# EAGLE design zeroAdaptor (EAGLE 7.1.0)
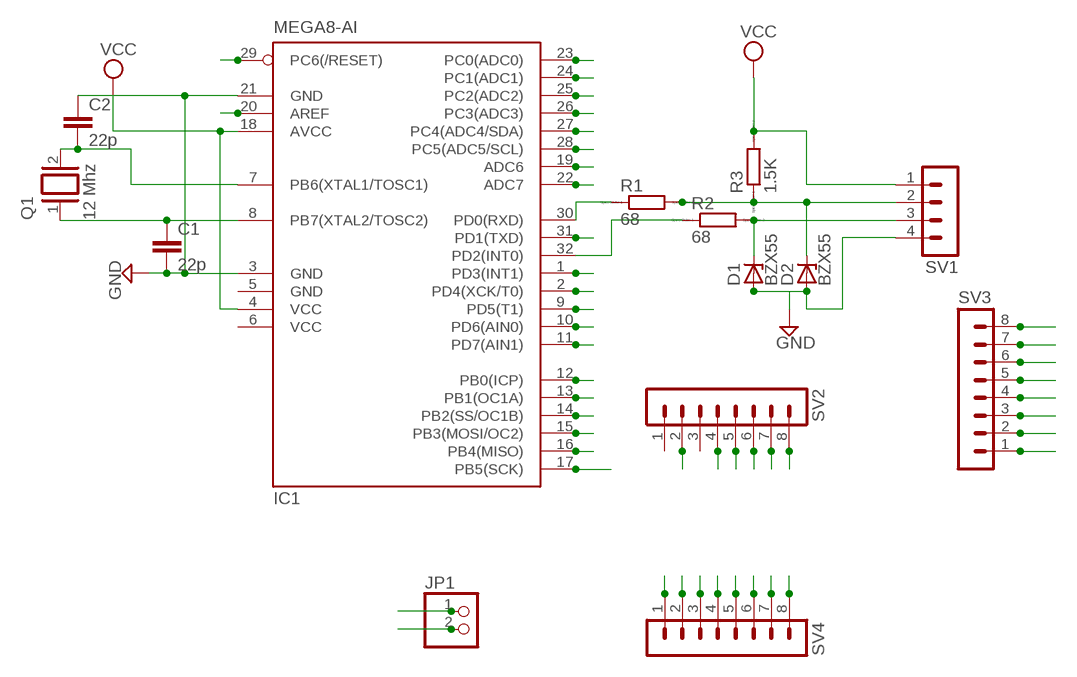
[diagram p0: schematic, sheet 1]

## Parts
C1  22p  C-EU025-024X044  [C025-024X044]
C2  22p  C-EU025-024X044  [C025-024X044]
D1  BZX55  [DO35Z10]
D2  BZX55  [DO35Z10]
IC1  MEGA8-AI  [TQFP32-08]
JP1  PINHD-1X2  [1X02]
Q1  12 Mhz  XTAL/S  [QS]
R1  68  R0204/7  [0204/7]
R2  68  R0204/7  [0204/7]
R3  1.5K  R0204/7  [0204/7]
SV1  MA04-1  [MA04-1]
SV2  MA08-1  [MA08-1]
SV3  MA08-1  [MA08-1]
SV4  MA08-1  [MA08-1]

## Nets
ADC6: IC1.19(ADC6) SV3.3
ADC7: IC1.22(ADC7) SV3.6
AREF: IC1.20(AREF) SV3.4
GND: C1.2 C2.1 D1.A D2.A IC1.3(GND) IC1.21(GND) SV1.4 SV3.5
N$1: C2.2 IC1.7(PB6(XTAL1/TOSC1)) Q1.2
N$2: C1.1 IC1.8(PB7(XTAL2/TOSC2)) Q1.1
N$3: IC1.30(PD0(RXD)) R1.1
N$4: IC1.32(PD2(INT0)) R2.1
N$6: D1.C R2.2 SV1.3
N$9: D2.C R1.2 R3.1 SV1.2
PB0: IC1.12(PB0(ICP)) SV4.4
PB1: IC1.13(PB1(OC1A)) SV4.5
PB2: IC1.14(PB2(SS/OC1B)) SV4.6
PB3: IC1.15(PB3(MOSI/OC2)) SV4.7
PB4: IC1.16(PB4(MISO)) SV4.8
PB5: IC1.17(PB5(SCK)) SV3.1
PC0: IC1.23(PC0(ADC0)) SV3.7
PC1: IC1.24(PC1(ADC1)) SV3.8
PC2: IC1.25(PC2(ADC2)) SV2.8
PC3: IC1.26(PC3(ADC3)) SV2.7
PC4: IC1.27(PC4(ADC4/SDA)) SV2.6
PC5: IC1.28(PC5(ADC5/SCL)) SV2.5
PC6: IC1.29(PC6(/RESET)) SV2.4
PD1: IC1.31(PD1(TXD)) SV2.2
PD3: IC1.1(PD3(INT1)) JP1.1
PD4: IC1.2(PD4(XCK/T0)) JP1.2
PD5: IC1.9(PD5(T1)) SV4.1
PD6: IC1.10(PD6(AIN0)) SV4.2
PD7: IC1.11(PD7(AIN1)) SV4.3
VCC: IC1.4(VCC) IC1.18(AVCC) R3.2 SV1.1 SV3.2
Unconnected: SV2.1 SV2.3

## Power pins joined to a net without a drawn wire
GND: IC1.5(GND)
VCC: IC1.6(VCC)

## Library data of the parts
C1 C2 = rcl:C-EU: CAPACITOR, European symbol
D1 D2 = diode:BZX55: Z DIODE
IC1 = atmel:MEGA8: MICROCONTROLLER 8 Kbytes FLASH, 1 kbytes SRAM, 512 bytes EEPROM, USART, 6-channel 10 bit ADC, 2-channel 8 bit ADC Pin compatible with Atmega48, ATMega88, ATMega168 Source: avr.lbr; MPN: ATMEGA8-16AU; OC_FARNELL: 9171371; OC_NEWARK: 73M8863
JP1 = pinhead:PINHD-1X2: PIN HEADER
Q1 = special:XTAL/S: CRYSTAL
R1-R3 = eagle-ltspice:R: RESISTOR, European symbol; SPICEMODEL: NONE; SPICEPREFIX: R
SV1 = con-lstb:MA04-1: PIN HEADER; OC_FARNELL: unknown; OC_NEWARK: unknown
SV2-SV4 = con-lstb:MA08-1: PIN HEADER; OC_FARNELL: unknown; OC_NEWARK: unknown

## Board
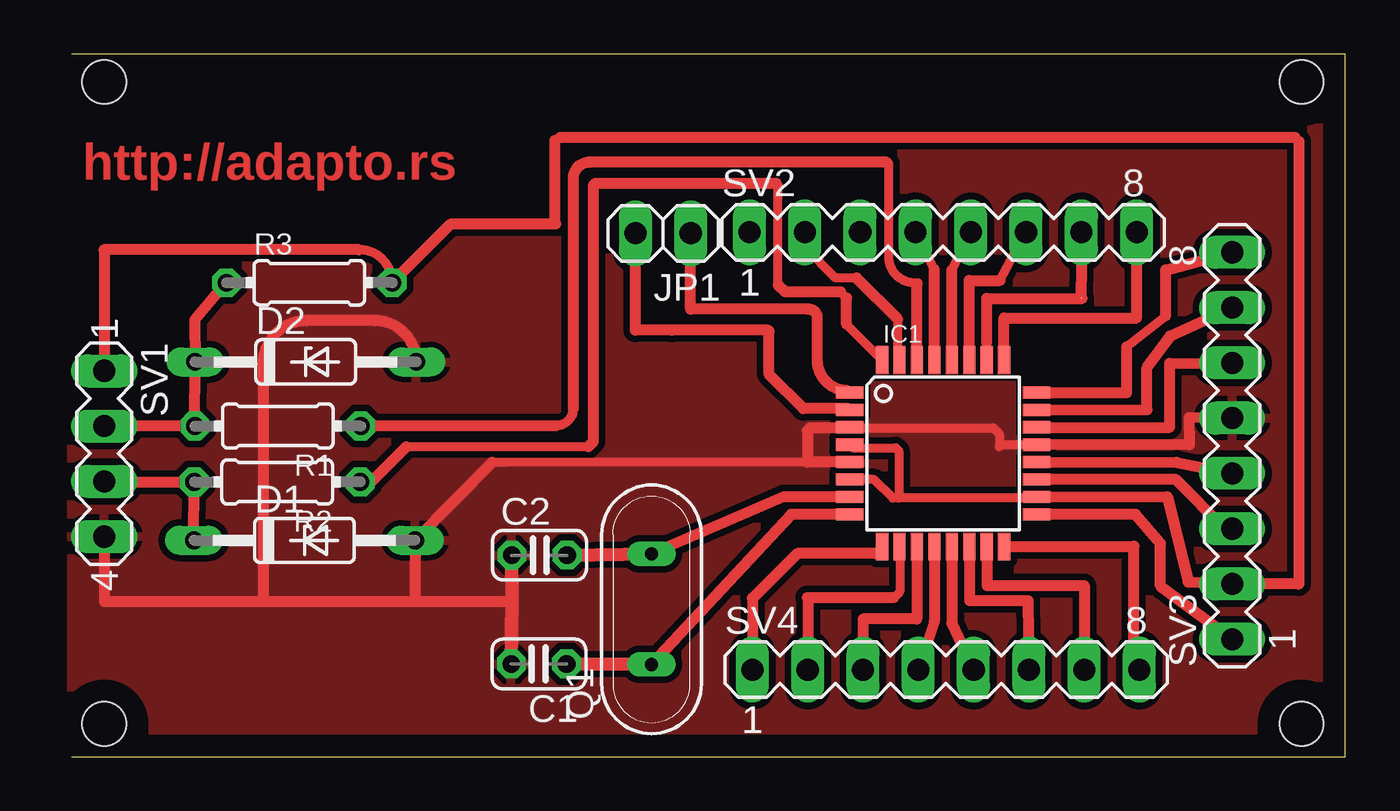
[diagram p1: board, top side]

Size 58.5 x 32.26 mm. Coordinates in mm from the lower left corner, seen from the top.
Outline: 0,0 58.5,0 58.5,32.26 0,32.26
Copper layers (1*16): Top 0.035mm / dielectric 1.5mm / Bottom 0.035mm
Design rules "default *": minimum track width 10mil, minimum drill 24mil, track to track 12mil, track to pad 12mil, pad to pad 12mil, via to via 12mil, smd to smd 12mil, copper to edge 40mil, drill to drill 8mil, minimum pad ring 10mil, minimum via ring 8mil, stop-mask expansion 4mil, vias tented up to drill 0mil, thermal gap 10mil
Holes 2 mm at 1.5,31 1.5,1.5 56.5,1.5 56.5,31

### Footprints (pad centres in the part's own frame; a part is rotated, then mirrored left to right if it is on the bottom)
C025-024X044 = drill 0.813 octagon: 1 -1.27,0; 2 1.27,0
DO35Z10 = drill 0.813 long: A 5.08,0; C -5.08,0
TQFP32-08 = smd 1.27 x 0.559: 1 -4.293,2.8; 2 -4.293,2; 3 -4.293,1.2; 4 -4.293,0.4; 5 -4.293,-0.4; 6 -4.293,-1.2; 7 -4.293,-2; 8 -4.293,-2.8; 17 4.293,-2.8; 18 4.293,-2; 19 4.293,-1.2; 20 4.293,-0.4; 21 4.293,0.4; 22 4.293,1.2; 23 4.293,2; 24 4.293,2.8 | smd 0.559 x 1.27: 9 -2.8,-4.293; 10 -2,-4.293; 11 -1.2,-4.293; 12 -0.4,-4.293; 13 0.4,-4.293; 14 1.2,-4.293; 15 2,-4.293; 16 2.8,-4.293; 25 2.8,4.293; 26 2,4.293; 27 1.2,4.293; 28 0.4,4.293; 29 -0.4,4.293; 30 -1.2,4.293; 31 -2,4.293; 32 -2.8,4.293
1X02 = drill 1.016 long: 1 -1.27,0; 2 1.27,0
QS = drill 0.61 long: 1 -2.54,0; 2 2.54,0
0204/7 = drill 0.813 octagon: 1 -3.81,0; 2 3.81,0
MA04-1 = drill 1.016 long: 1 -3.81,0; 2 -1.27,0; 3 1.27,0; 4 3.81,0
MA08-1 = drill 1.016 long: 1 -8.89,0; 2 -6.35,0; 3 -3.81,0; 4 -1.27,0; 5 1.27,0; 6 3.81,0; 7 6.35,0; 8 8.89,0

### Placement (x,y rotation side)
C1  21.47,4.25 180 top
C2  21.5,9.25 0 top
D1  10.7,9.93 0 top
D2  10.76,18.13 0 top
IC1  40.04,13.93 0 top
JP1  27.17,24.04 180 top
Q1  26.64,6.77 90 top
R1  9.48,15.19 180 top
R2  9.45,12.62 180 top
R3  10.92,21.77 0 top
SV1  1.5,13.91 270 top
SV2  40.04,24.09 0 top
SV3  53.32,14.28 90 top
SV4  40.17,3.99 0 top

### Tracks (layer width: path | path; a pad name or v marks a point on that pad's centre or on a via)
ADC6
  Top 0.406: IC1.19 44.35,12.75 | 52.99,10.47 SV3.3
  Top 0.5: 44.35,12.75 50.7,12.75 52.99,10.47
ADC7
  Top 0.5: IC1.22 50.45,15.12 50.45,18.06 SV3.6
AREF
  Top 0.5: IC1.20 50.77,13.52 SV3.4
GND
  Top 0.406: 15.78,7.13 15.94,7.13 | 33.8,13.53 19.92,13.51 19.33,13.51 | 35.72,15.11 IC1.3 35.77,15.11 42.34,15.11 42.62,14.83 42.62,14.23 42.72,14.33 IC1.21 | 33.94,15.11 33.8,14.97
  Top 0.5: SV3.5 51.33,15.57 51.35,14.32 IC1.21 | 15.78,7.13 D1.A 19.33,13.51 | 20.24,7.12 15.94,7.13 8.8,7.13 | SV1.4 1.51,7.13 8.8,7.13 | IC1.5 33.8,13.53 33.8,14.97 | D2.A arc90 13.94,20.03 10.8,20.03 arc90 8.8,18.04 8.8,7.13 | 35.72,15.11 33.94,15.11
  Top 0.61: C1.2 20.24,7.12 C2.1
  pour Top: 0,32 58.5,32 58.5,0 0,0
N$1
  Top 0.5: IC1.7 32.71,11.94 Q1.2
  Top 0.61: Q1.2 C2.2
N$2
  Top 0.5: IC1.8 33.06,11.14 Q1.1
  Top 0.61: Q1.1 C1.1
N$3
  Top 0.406: 38.84,21.71 arc-90 38.88,21.76 38.74,21.76 arc-90 37.54,22.96 37.54,27.21 arc90 37.45,27.3 | 23.04,15.98 arc-90 22.26,15.2 | R1.1 arc90 R1.1
  Top 0.5: IC1.30 38.84,21.71 | 37.45,27.3 23.78,27.3 arc90 23.04,26.56 23.04,15.98 | 22.26,15.2 R1.1
N$4
  Top 0.406: IC1.32 35.6,19.86 | 35.6,21.07 35.33,21.34 | 32.46,21.67 32.46,26.24 32.37,26.33 | 24.06,26.33 23.97,26.24 | 23.73,14.23 15.38,14.23 | 13.77,12.62 R2.1
  Top 0.5: 35.6,19.86 35.6,21.07 | 35.33,21.34 32.79,21.34 32.46,21.67 | 32.37,26.33 24.06,26.33 | 23.97,26.24 23.97,14.46 23.73,14.23 | 15.38,14.23 13.77,12.62
N$6
  Top 0.406: SV1.3 1.53,12.62
  Top 0.5: D1.C R2.2 1.53,12.62
N$9
  Top 0.5: SV1.2 R1.2 D2.C 5.66,20.07 R3.1
PB0
  Top 0.5: IC1.12 39.63,6.2 SV4.4
PB1
  Top 0.5: IC1.13 40.44,6.13 SV4.5
PB2
  Top 0.5: IC1.14 41.25,7.17 43.94,7.17 SV4.6
PB3
  Top 0.5: IC1.15 42.06,7.86 46.52,7.86 SV4.7
PB4
  Top 0.406: SV4.8 48.81,4.24 | 48.81,9.65 48.79,9.64
  Top 0.5: 48.81,4.24 48.81,9.65 | 48.79,9.64 IC1.16
PB5
  Top 0.5: SV3.1 50.02,7.82 50.02,9.79 48.87,11.13 IC1.17
PC0
  Top 0.5: SV3.7 50.47,19.33 49.41,17.87 49.41,15.95 IC1.23
PC1
  Top 0.406: 48.47,18.83 50.26,20.25
  Top 0.5: IC1.24 48.47,16.72 48.47,18.83 | 50.26,20.25 50.26,22.36 SV3.8
PC2
  Top 0.5: SV2.8 48.93,22.82 48.93,22.03 48.93,20.15 42.84,20.15 IC1.25
PC3  (1 unrouted)
  Top 0.406: IC1.26 42.04,21.05 46.4,21.05 SV2.7 | 46.43,21.05 SV2.7 46.4,24.13 | 42.04,20.98 42.07,21.01 42.07,21.08 46.4,21.08
  Top 0.5: 42.04,19.01 42.04,21.05 46.43,21.05 | 46.4,21.08 46.43,23.96
PC4
  Top 0.406: 42.65,21.88 SV2.6
  Top 0.5: IC1.27 41.24,21.88 42.65,21.88
PC5
  Top 0.406: 40.44,22.33 SV2.5
  Top 0.5: IC1.28 40.44,22.33
PC6
  Top 0.406: 39.63,22.39 SV2.4
  Top 0.5: IC1.29 39.63,22.39
PD1
  Top 0.406: IC1.31 37.96,18.3 37.96,20.1 | 36.06,21.99 35.09,21.99 33.69,23.4 SV2.2
  Top 0.5: 37.96,20.1 36.06,21.99
PD3
  Top 0.406: IC1.1 arc90 35.66,16.82 35.65,16.82 | 28.45,20.56 arc-90 28.45,20.56
  Top 0.5: 35.65,16.82 arc-90 34.26,18.2 34.26,20.14 arc90 33.85,20.56 28.45,20.56 | 28.45,20.56 JP1.1
PD4
  Top 0.406: IC1.2 35.69,15.98 | 32.05,19.54 32,19.59 | 25.91,19.59
  Top 0.5: 35.69,15.98 33.62,15.98 32.05,17.55 32.05,19.54 | 32,19.59 27.57,19.59 25.91,19.59 | 25.91,19.59 JP1.2
PD5
  Top 0.406: IC1.9 36.93,9.33
  Top 0.5: 36.93,9.33 33.34,9.33 31.28,7.27 SV4.1
PD6
  Top 0.406: IC1.10 38.05,9.62 38.05,7.58 37.77,7.3 | 33.8,7.3 33.82,7.28
  Top 0.5: 37.77,7.3 33.8,7.3 | 33.82,7.28 SV4.2
PD7
  Top 0.5: IC1.11 38.83,6.32 36.36,6.32 SV4.3
VCC
  Top 0.406: R3.2 arc90 13.21,23.29 | 1.49,23.29 arc-90 1.5,23.28 | 22.26,24.48 22.21,24.53 | 22.21,28.32 22.44,28.46 | 56.2,28.46 56.38,28.27 | 56.38,7.95 56.37,7.93 | IC1.18 44.27,11.87 38.01,11.87 | 38.01,11.87 37.73,11.87 36.87,12.73 IC1.6 | IC1.4 35.89,14.18 37.87,14.18 38.01,14.04 38.01,11.87
  Top 0.5: IC1.18 50.33,11.94 51.29,8.01 SV3.2 56.37,7.93 | 13.21,23.29 1.49,23.29 | 1.5,23.28 SV1.1 | R3.2 17.45,24.48 22.26,24.48 | 22.21,24.53 22.21,28.32 | 22.44,28.46 56.2,28.46 | 56.38,28.27 56.38,7.95

### Text on the board
Top: http://adapto.rs